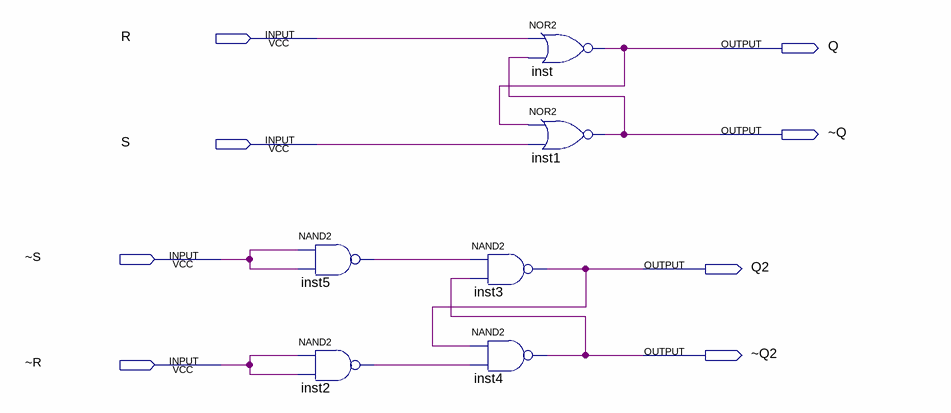
[diagram p0: schematic sheet]
// Quartus schematic lab9step1.bdf as structural Verilog: 6 symbols, 8 pins
module lab9step1 (
  input  R,
  input  S,
  input  \~S ,
  input  \~R ,
  output Q,
  output \~Q ,
  output Q2,
  output \~Q2 
);

  wire inst2_out, inst5_out;

  nand inst5 (inst5_out, \~S , \~S );
  nand inst2 (inst2_out, \~R , \~R );
  nand inst3 (Q2, inst5_out, \~Q2 );
  nand inst4 (\~Q2 , Q2, inst2_out);
  nor inst (Q, R, \~Q );
  nor inst1 (\~Q , Q, S);
endmodule
